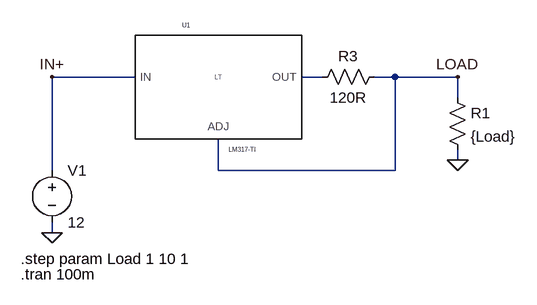
[diagram p0: schematic LM317 Current Regulator (figure 26 On Semiconductor).asc]
LM317 Current Regulator (figure 26 On Semiconductor).asc, the LTspice schematic file:
Version 4
SHEET 1 880 680
WIRE 80 96 -48 96
WIRE 368 96 336 96
WIRE 480 96 448 96
WIRE 576 96 480 96
WIRE 576 128 576 96
WIRE 576 224 576 208
WIRE -48 240 -48 96
WIRE 208 240 208 192
WIRE 480 240 480 96
WIRE 480 240 208 240
WIRE -48 336 -48 320
FLAG -48 336 0
FLAG -48 96 IN+
FLAG 576 224 0
FLAG 576 96 LOAD
SYMBOL Regulators\\LM317-TI 208 96 R0
SYMATTR InstName U1
SYMBOL res 352 112 R270
WINDOW 0 32 56 VTop 2
WINDOW 3 0 56 VBottom 2
SYMATTR InstName R3
SYMATTR Value 120R
SYMBOL voltage -48 224 R0
WINDOW 123 0 0 Left 0
WINDOW 39 0 0 Left 0
SYMATTR InstName V1
SYMATTR Value 12
SYMBOL res 560 112 R0
SYMATTR InstName R1
SYMATTR Value {Load}
TEXT -96 400 Left 2 !.tran 100m
TEXT -96 376 Left 2 !.step param Load 1 10 1

The netlist it stands for:
* LM317 Current Regulator (figure 26 On Semiconductor).asc
XU1 IN+ LOAD N001 LM317-TI  ; pins IN ADJ OUT
R3 N001 LOAD 120R
V1 IN+ 0 12
R1 LOAD 0 {Load}
.tran 100m
.step param Load 1 10 1
.lib LM317-TI.LIB
.backanno
.end